# Altium schematic sheet 2_MCU.SchDoc
size A3; DocumentNumber: 3; SheetNumber: 3; SheetTotal: 6; PageSetup: Record=PageOptions|CenterHorizontal=True|CenterVertical=True|PrintScale=1.01|XCorrection=1.00|YCorrection=1.00|PrintKind=0|BorderSize=5000000|LeftOffset=0|BottomOffset=0|Orientation=2|PaperLength=1000|PaperWidth=1000|Scale=100|PaperSource=7|PrintQuality=-4|MediaType=1|DitherType=10|PaperKind=A3|PrintScaleMode=1
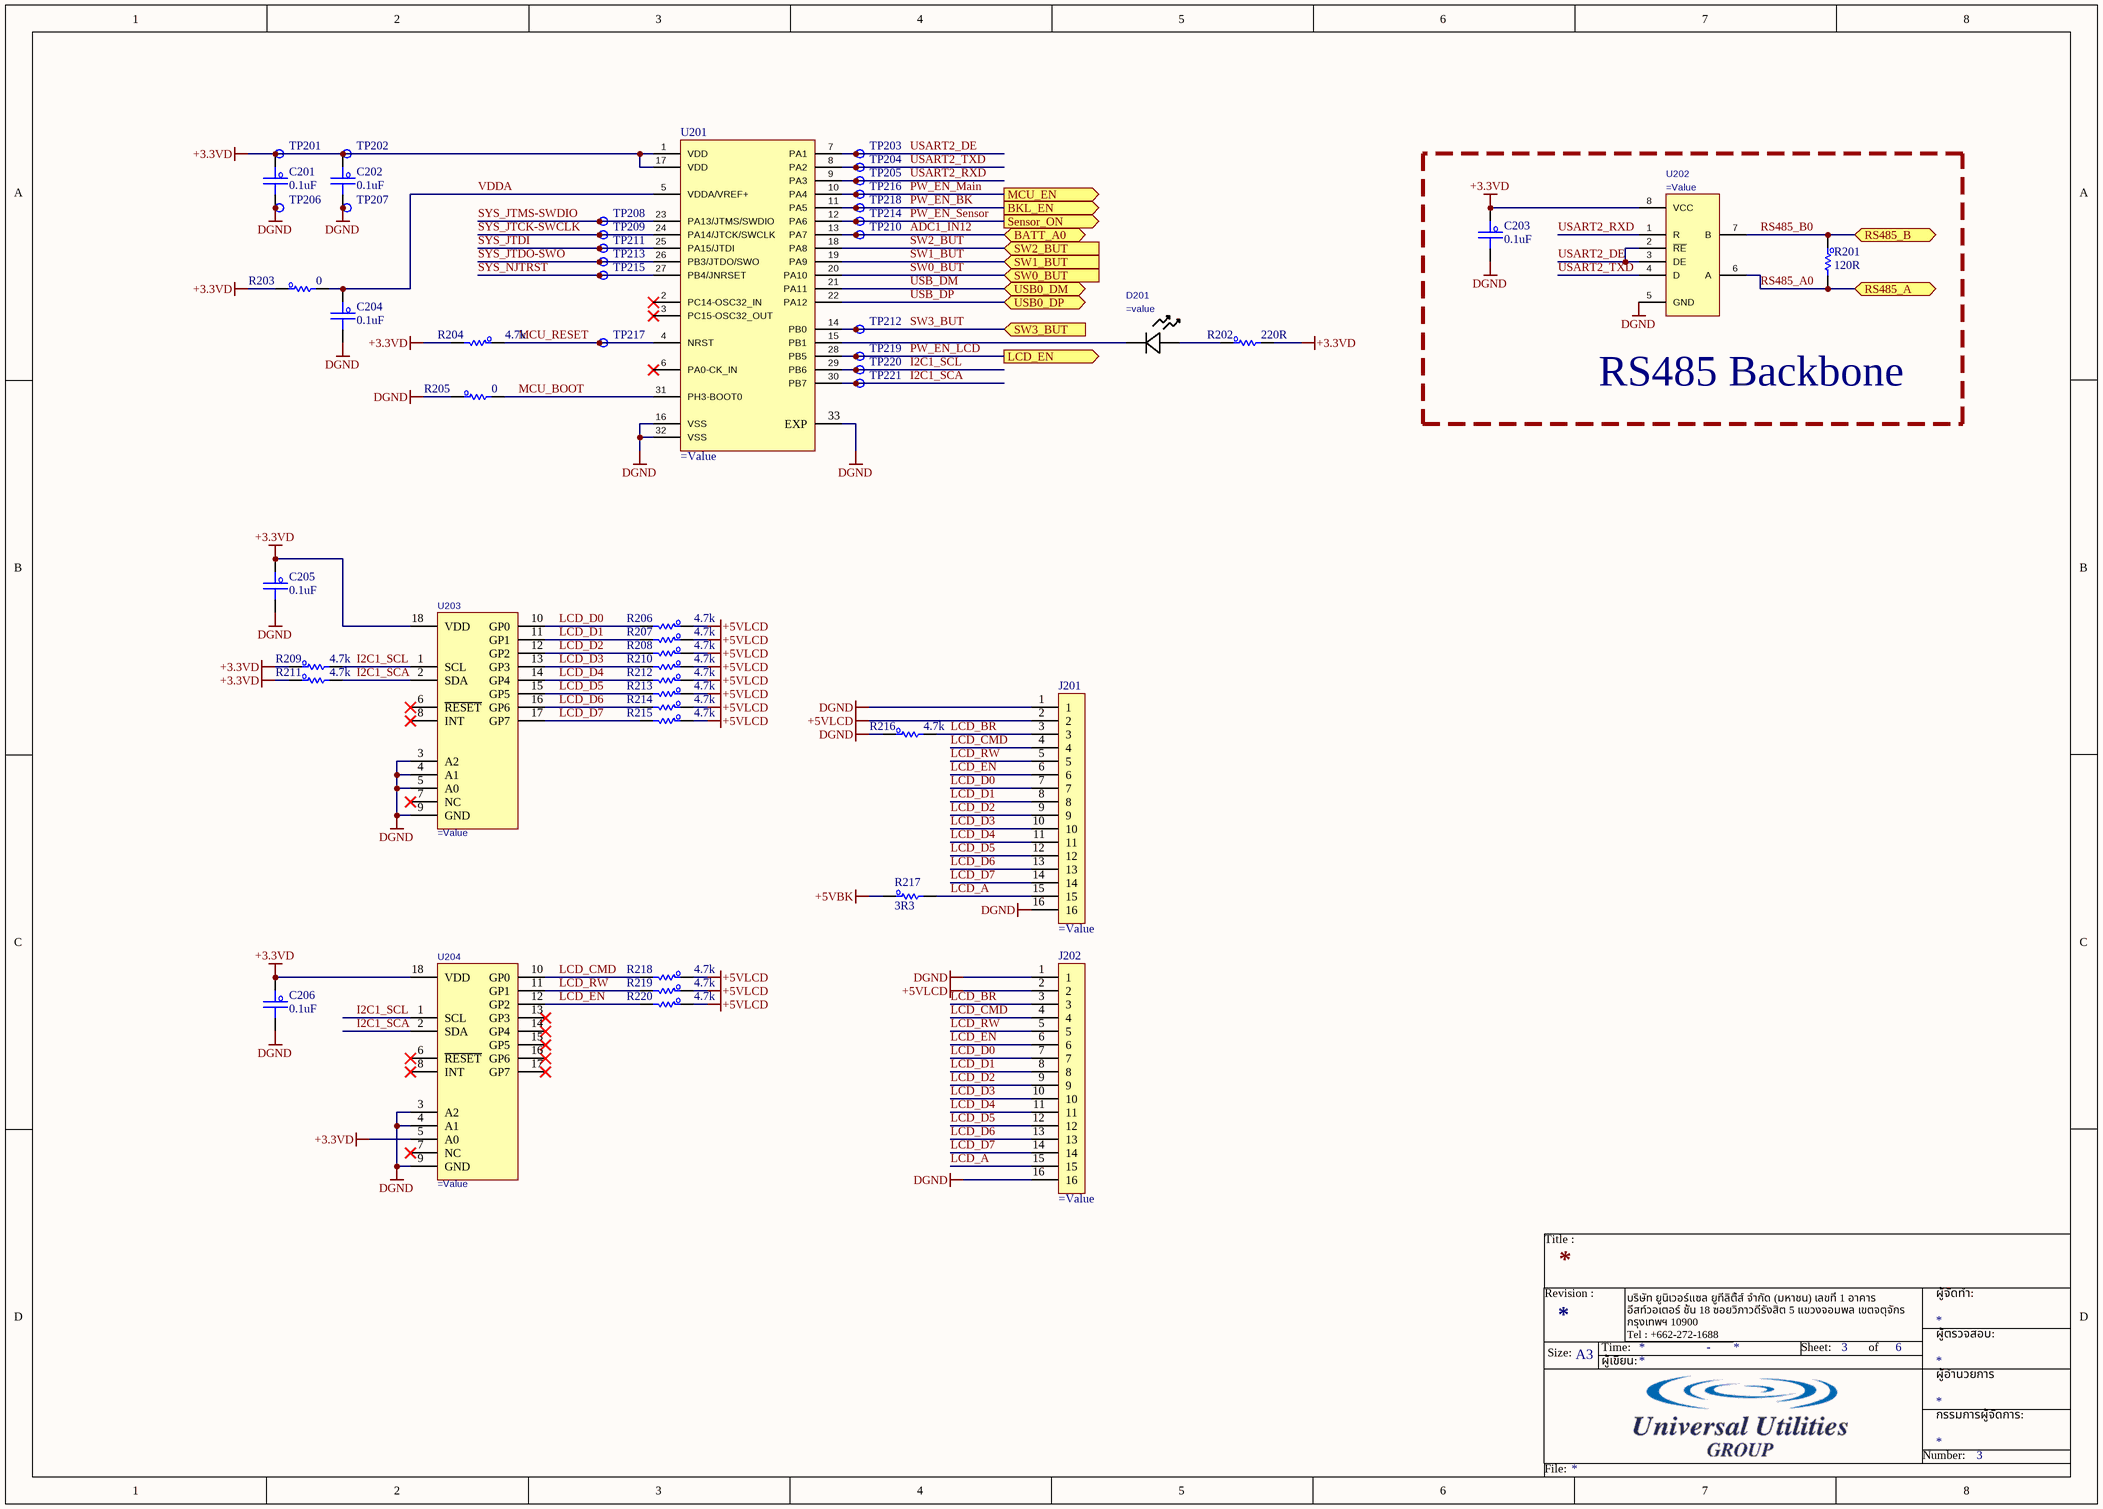
[diagram p0: 2_MCU.SchDoc]

## Parts
C201  0.1uF  [C_0603]
C202  0.1uF  [C_0603]
C203  0.1uF  [C_0603]
C204  0.1uF  [C_0603]
C205  0.1uF  [C_0603]
C206  0.1uF  [C_0603]
D201  (no value)  [LED_0VS75000_WRE]
J201  (no value)  [CON_16P_Header]
J202  (no value)  [CON_16P_Header]
R201  120R  [R_0603]
R202  220R  [R_0603]
R203  0  [R_0603]
R204  4.7k  [R_0603]
R205  0  [R_0603]
R206  4.7k  [R_0603]
R207  4.7k  [R_0603]
R208  4.7k  [R_0603]
R209  4.7k  [R_0603]
R210  4.7k  [R_0603]
R211  4.7k  [R_0603]
R212  4.7k  [R_0603]
R213  4.7k  [R_0603]
R214  4.7k  [R_0603]
R215  4.7k  [R_0603]
R216  4.7k  [R_0603]
R217  3R3  [R_2512]
R218  4.7k  [R_0603]
R219  4.7k  [R_0603]
R220  4.7k  [R_0603]
TP201  (no value)  [TP_Testpoint]  (no BOM)
TP202  (no value)  [TP_Testpoint]  (no BOM)
TP203  (no value)  [TP_Testpoint]  (no BOM)
TP204  (no value)  [TP_Testpoint]  (no BOM)
TP205  (no value)  [TP_Testpoint]  (no BOM)
TP206  (no value)  [TP_Testpoint]  (no BOM)
TP207  (no value)  [TP_Testpoint]  (no BOM)
TP208  (no value)  [TP_Testpoint]  (no BOM)
TP209  (no value)  [TP_Testpoint]  (no BOM)
TP210  (no value)  [TP_Testpoint]  (no BOM)
TP211  (no value)  [TP_Testpoint]  (no BOM)
TP212  (no value)  [TP_Testpoint]  (no BOM)
TP213  (no value)  [TP_Testpoint]  (no BOM)
TP214  (no value)  [TP_Testpoint]  (no BOM)
TP215  (no value)  [TP_Testpoint]  (no BOM)
TP216  (no value)  [TP_Testpoint]  (no BOM)
TP217  (no value)  [TP_Testpoint]  (no BOM)
TP218  (no value)  [TP_Testpoint]  (no BOM)
TP219  (no value)  [TP_Testpoint]  (no BOM)
TP220  (no value)  [TP_Testpoint]  (no BOM)
TP221  (no value)  [TP_Testpoint]  (no BOM)
U201  (no value)  [QFN50P500X500X60-33N]
U202  (no value)  [D0008A_L]
U203  (no value)  [SOIC127P1030X265-18N]
U204  (no value)  [SOIC127P1030X265-18N]

## Blocks framed on the sheet
RS485 Backbone: C203 R201 U202

## Ports
BATT_A0 (bidir), BKL_EN (out), LCD_EN (out), MCU_EN (out), RS485_A (bidir), RS485_B (bidir), Sensor_ON (out), SW0_BUT (in), SW1_BUT (in), SW2_BUT (in), SW3_BUT (in), USB0_DM (bidir), USB0_DP (bidir)

## Nets
+3.3VD: C201.1 C202.1 C203.1 C205.1 C206.1 R202.2 R203.1 R204.2 R209.1 R211.1 TP201.1 TP202.1 U201.1(VDD) U201.17(VDD) U202.8(VCC) U203.18(VDD) U204.5(A0) U204.18(VDD)
+5VBK: R217.1
+5VLCD: J201.2 J202.2 R206.1 R207.1 R208.1 R210.1 R212.1 R213.1 R214.1 R215.1 R218.1 R219.1 R220.1
DGND: C201.2 C202.2 C203.2 C204.2 C205.2 C206.2 J201.1 J201.16 J202.1 J202.16 R205.1 R216.1 TP206.1 TP207.1 U201.16(VSS) U201.32(VSS) U201.33(EXP) U202.5(GND) U203.3(A2) U203.4(A1) U203.5(A0) U203.9(GND) U204.3(A2) U204.4(A1) U204.9(GND)
ADC1_IN12: TP210.1 U201.13(PA7) ; port BATT_A0
I2C1_SCA: R211.2 TP221.1 U201.30(PB7) U203.2(SDA) U204.2(SDA)
I2C1_SCL: R209.2 TP220.1 U201.29(PB6) U203.1(SCL) U204.1(SCL)
LCD_A: J201.15 J202.15 R217.2
LCD_BR: J201.3 J202.3 R216.2
LCD_CMD: J201.4 J202.4 R218.2 U204.10(GP0)
LCD_D0: J201.7 J202.7 R206.2 U203.10(GP0)
LCD_D1: J201.8 J202.8 R207.2 U203.11(GP1)
LCD_D2: J201.9 J202.9 R208.2 U203.12(GP2)
LCD_D3: J201.10 J202.10 R210.2 U203.13(GP3)
LCD_D4: J201.11 J202.11 R212.2 U203.14(GP4)
LCD_D5: J201.12 J202.12 R213.2 U203.15(GP5)
LCD_D6: J201.13 J202.13 R214.2 U203.16(GP6)
LCD_D7: J201.14 J202.14 R215.2 U203.17(GP7)
LCD_EN: J201.6 J202.6 R220.2 U204.12(GP2)
LCD_RW: J201.5 J202.5 R219.2 U204.11(GP1)
MCU_BOOT: R205.2 U201.31(PH3-BOOT0)
MCU_RESET: R204.1 TP217.1 U201.4(NRST)
PW_EN_BK: TP218.1 U201.11(PA5) ; port BKL_EN
PW_EN_LCD: TP219.1 U201.28(PB5) ; port LCD_EN
PW_EN_Main: TP216.1 U201.10(PA4) ; port MCU_EN
PW_EN_Sensor: TP214.1 U201.12(PA6) ; port Sensor_ON
RS485_A0: R201.2 U202.6(A) ; port RS485_A
RS485_B0: R201.1 U202.7(B) ; port RS485_B
SW0_BUT: U201.20(PA10) ; port SW0_BUT
SW1_BUT: U201.19(PA9) ; port SW1_BUT
SW2_BUT: U201.18(PA8) ; port SW2_BUT
SW3_BUT: TP212.1 U201.14(PB0) ; port SW3_BUT
SYS_JTCK-SWCLK: TP209.1 U201.24(PA14/JTCK/SWCLK)
SYS_JTDI: TP211.1 U201.25(PA15/JTDI)
SYS_JTDO-SWO: TP213.1 U201.26(PB3/JTDO/SWO)
SYS_JTMS-SWDIO: TP208.1 U201.23(PA13/JTMS/SWDIO)
SYS_NJTRST: TP215.1 U201.27(PB4/JNRSET)
USART2_DE: TP203.1 U201.7(PA1) U202.2(~{RE}) U202.3(DE)
USART2_RXD: TP205.1 U201.9(PA3) U202.1(R)
USART2_TXD: TP204.1 U201.8(PA2) U202.4(D)
USB_DM: U201.21(PA11) ; port USB0_DM
USB_DP: U201.22(PA12) ; port USB0_DP
VDDA: C204.1 R203.2 U201.5(VDDA/VREF+)
NetD201_1: D201.1 R202.1
NetD201_2: D201.2 U201.15(PB1)

Not connected (* = marked no-connect by the designer): U201 2(PC14-OSC32_IN)* 3(PC15-OSC32_OUT)* 6(PA0-CK_IN)*; U203 6(~{RESET})* 7(NC)* 8(INT)*; U204 6(~{RESET})* 7(NC)* 8(INT)* 13(GP3)* 14(GP4)* 15(GP5)* 16(GP6)* 17(GP7)*

## Notes on the sheet
- Title :
- Revision :
- ผู้จัดทำ:
- Size:
- A3
- Time:
- ผู้เขียน:
- บริษัท ยูนิเวอร์แซล ยูทีลิตี้ส์ จำกัด (มหาชน) เลขที่ 1 อาคาร อีสท์วอเตอร์ ชั้น 18 ซอยวิภาวดีรังสิต 5 แขวงจอมพล เขตจตุจักร กรุงเทพฯ 10900
  Tel : +662-272-1688
  Fax :+662-2721690-1
- -
- Sheet:
- of
- ผู้อำนวยการ
- ผู้ตรวจสอบ:
- Number:
- กรรมการผู้จัดการ:
- File:

## Library data of the parts
C201-C206 = C_Capacitor: CAP CER 0.1UF 50V X7R 0603; Manufacturer: KEMET; PartNumber: C0603C104K5RACTU; PackageReference: 0603; PartID: 399-5089-1-ND; Value2: 50V; Value: 0.1uF; Value3: *
D201 = D_LED_150060BS75000: LED BLUE CLEAR 0603 SMD; Manufacturer: Wurth Electronics; Value: 150060VS75000; PackageReference: 0603; PartID: 732-4980-1-ND; PartNumber: 150060VS75000
J201 J202 = CON_16P_Heder: Connector 6 position; PartNumber: *; PartID: *; Manufacturer: *; PackageReference: *; Value: *; Value2: *; Value3: *
R201 = R_Resister: RES SMD 120 OHM 1% 1/3W 0603; Manufacturer: Vishay Dale; PartNumber: CRCW0603120RFKEAHP; Value2: 0.333W; Value: 120R; PackageReference: 0603; PartID: 541-120SCT-ND; Value3: *
R202 = R_Resister: RES SMD 220 OHM 1% 1/10W 0603; Manufacturer: Vishay Dale; PartNumber: CRCW0603220RFKEAC; Value2: 0.1W; Value: 220R; PackageReference: 0603; PartID: 541-4047-1-ND; Value3: *
R203 R205 = R_Resister: RES SMD 0 OHM JUMP 1/10W 0603; Manufacturer: Vishay Dale; PartNumber: CRCW06030000Z0EBC; Value2: 0.1W; Value: 0; PackageReference: 0603; PartID: 541-4013-1-ND; Value3: *
R204 R206-R216 R218-R220 = R_Resister: RES 4.7K OHM 5% 1/10W 0603; Manufacturer: Vishay Dale; PartNumber: CRCW06034K70JNEBC; Value2: 0.1W; Value: 4.7k; PackageReference: 0603; PartID: 541-CRCW06034K70JNEBCCT-ND; Value3: *
R217 = R_Resister: RES SMD 3.3 OHM 5% 3W 2512; Manufacturer: Vishay; PartNumber: 35223R3JT; Value: 3R3; PackageReference: 2512; PartID: A121247CT-ND; Value2: 3W; Value3: 5%
TP201-TP221 = TP_TestPoint: TestPoint; Manufacturer: *; PackageReference: *; PartID: *; PartNumber: *; Value2: *; Value3: *
U201 = IC_MCU_STM32L432: IC MCU 32BIT 256KB FLSH 32UFQFPN; PartNumber: STM32L432KCU6; Manufacturer: STMicroelectronics; Value: STM32L432KCU6; PartID: 497-16578-ND; PackageReference: *; Value2: *; Value3: *
U202 = IC_TRAN_THVD1505DR: IC TRANSCEIVER HALF 1/1 8SOIC; Manufacturer: Texas Instruments; PartNumber: SN65HVD11DR; Value: SN65HVD11DR; PackageReference: 8SOIC; PartID: 0086-0766-1; Value3: SN65HVD11DR
U203 U204 = IC_INTERF_MCP23008-E/SO: IC I/O EXPANDER I2C 8B 18SOIC; Manufacturer: Microchip Technology; PartNumber: MCP23008-E/SO; Value: MCP23008-E/SO; PackageReference: 18-SOIC; PartID: 0035-0598-4